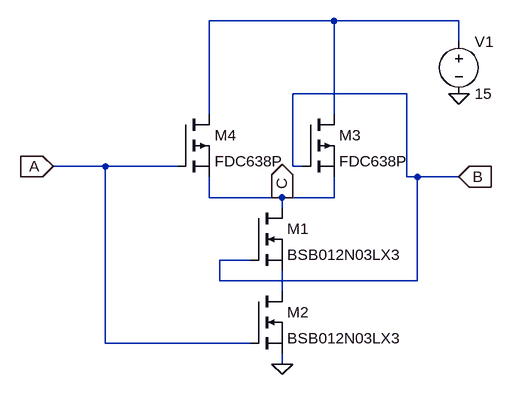
[diagram p0: schematic Draft1.asc]
Draft1.asc, the LTspice schematic file:
Version 4
SHEET 1 880 680
WIRE 288 -240 96 -240
WIRE 480 -240 288 -240
WIRE 480 -208 480 -240
WIRE 400 -128 224 -128
WIRE 96 -96 96 -240
WIRE 288 -96 288 -240
WIRE -64 -16 -144 -16
WIRE 48 -16 -64 -16
WIRE 224 -16 224 -128
WIRE 240 -16 224 -16
WIRE 400 0 400 -128
WIRE 416 0 400 0
WIRE 480 0 416 0
WIRE 96 32 96 0
WIRE 208 32 96 32
WIRE 288 32 288 0
WIRE 288 32 208 32
WIRE 208 48 208 32
WIRE 160 128 112 128
WIRE 112 160 112 128
WIRE 416 160 416 0
WIRE 416 160 112 160
WIRE 208 176 208 144
WIRE -64 256 -64 -16
WIRE 160 256 -64 256
WIRE 208 288 208 272
FLAG 480 -128 0
FLAG 208 288 0
FLAG -144 -16 A
IOPIN -144 -16 In
FLAG 208 32 C
IOPIN 208 32 Out
FLAG 480 0 B
IOPIN 480 0 In
SYMBOL nmos 160 48 R0
SYMATTR InstName M1
SYMATTR Value BSB012N03LX3
SYMBOL nmos 160 176 R0
SYMATTR InstName M2
SYMATTR Value BSB012N03LX3
SYMBOL pmos 240 -96 R0
SYMATTR InstName M3
SYMATTR Value FDC638P
SYMBOL pmos 48 -96 R0
SYMATTR InstName M4
SYMATTR Value FDC638P
SYMBOL voltage 480 -224 R0
SYMATTR InstName V1
SYMATTR Value 15

The netlist it stands for:
* Draft1.asc
M1 C B N002 N002 BSB012N03LX3
M2 N002 A 0 0 BSB012N03LX3
M3 N001 B C C FDC638P
M4 N001 A C C FDC638P
V1 N001 0 15
.model NMOS NMOS
.model PMOS PMOS
.lib standard.mos
.backanno
.end